# Altium schematic sheet AnalogMeas.SchDoc
size A4; SheetNumber: 8; SheetTotal: 8
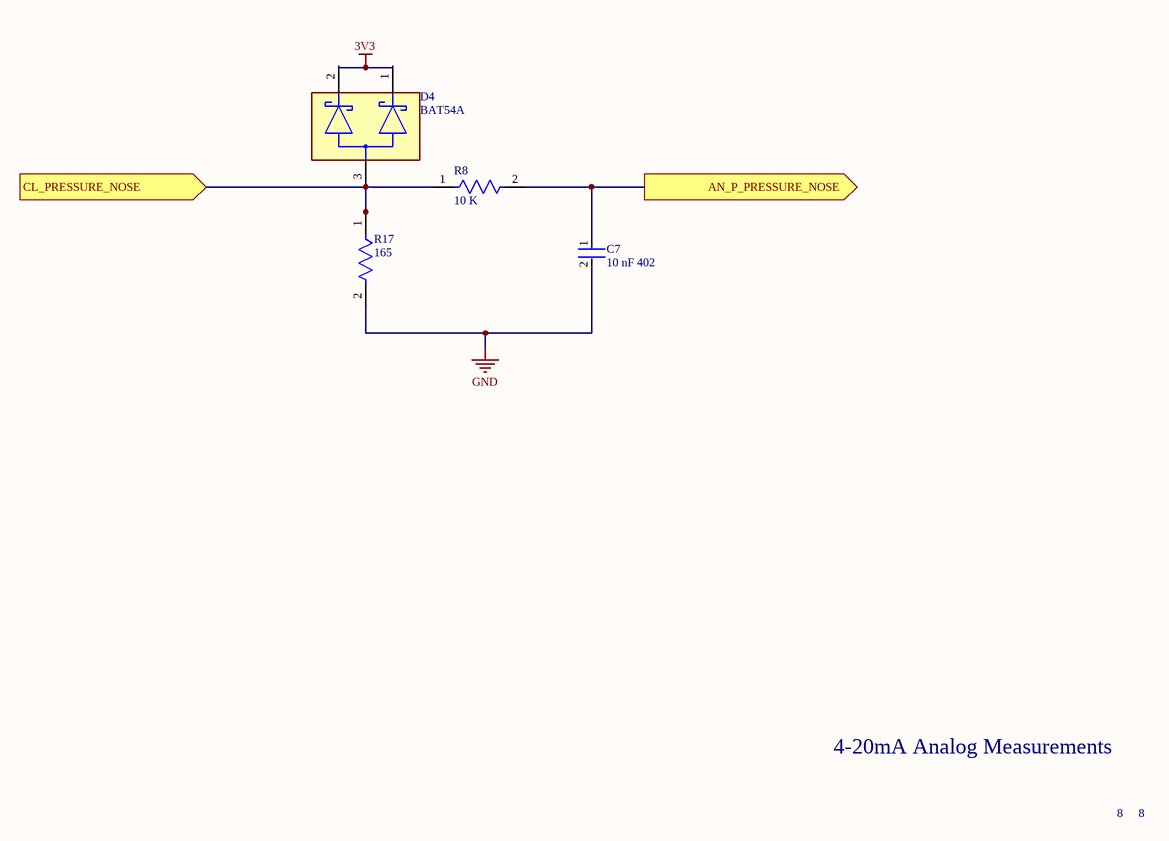
[diagram p0: AnalogMeas.SchDoc]

## Parts
C7  10 nF 402  [FP-GJM155-0_05-IPC_C]
D4  BAT54A  [FP-BAT54A-IPC_B]
R8  10 K  [FP-RP73P-1E-MFG]
R17  165  [FP-RP73P-1E-MFG]

## Ports
AN_P_PRESSURE_NOSE (out), CL_PRESSURE_NOSE (in)

## Nets
3V3: D4.1(1_CATHODE) D4.2(2_CATHODE)
GND: C7.2 R17.2
AN_P_PRESSURE_NOSE: C7.1 R8.2 ; port AN_P_PRESSURE_NOSE
CL_PRESSURE_NOSE: D4.3(COMMON_ANODE) R8.1 R17.1 ; port CL_PRESSURE_NOSE

## Notes on the sheet
- 4-20mA Analog Measurements
- 8

## Library data of the parts
C7 = CMP-2008-03910-2: Multi-Layer Ceramic Capacitor 0.75pF C0G  ±0.1pF 0402 Paper T/R; Voltage Rating: 50V; Min Operating Temperature: -55°C; Case Code (Metric): 1005; Radiation Hardening: No; Dielectric: C0G; Packaging: Tape and Reel; Max Operating Temperature: 125°C; Length: 1mm; Thickness: 0.022inch; Width: 0.02inch; Depth: 0.5mm; Capacitance: 0.75pF; Termination: SMD/SMT; Construction: Flat; Case/Package: 0402; Package Quantity: 1; Lead Free: Lead Free; Height: 0.5mm; Case Code (Imperial): 0402; Mount: Surface Mount; Voltage Rating (DC): 50V; Series: GJM
D4 = CMP-90577-000001-1: Schottky Diodes & Rectifiers SOT23CA.0.2A 30V Sch ottky; Capacitance: 10pF; Current Rating: 200mA; Forward Voltage: 1V; Lead Free: Lead Free; Packaging: Tape and Reel; REACH SVHC: No SVHC; Case/Package: SOT-23; Voltage Rating (DC): 30V; Number of Pins: 3
R8 R17 = CMP-03211-011177-1: RP73P 0402 165Ω 0.1W 25ppm/°C 0.10% 50V; Manufacturer Part Number: RP73PF1E165RBTD; Manufacturer: TE Connectivity; Octopart: https://octopart.com/rp73pf1e165rbtd-te+connectivity-89229973; ComponentLink2Description: Datasheet; Value: 165Ω; Temperature Coefficient: 25ppm/°C; Device Class L2: Resistors; Device Class L3: Chip SMD Resistors; Ipc Land Pattern Name: RESC10050X30; Voltage Rating: 50V; Resistance: 165Ω; Tolerance: 0.10%; Temperature Range Low: -55°C; Package: RP73P-1E; Power Rating: 0.1W; Device Class L1: Passive Components; Lead Free: Yes; Temperature: -55°C to +155°C; Height: 0.35mm; Temperature Range High: +155°C; ComponentLink2URL: https://www.te.com/commerce/DocumentDelivery/DDEController?Action=srchrtrv&DocNm=1773272&DocType=DS&DocLang=English; Automotive: No; Composition: Thin Film; Series: RP73P; RoHS: TRUE; Category: Res